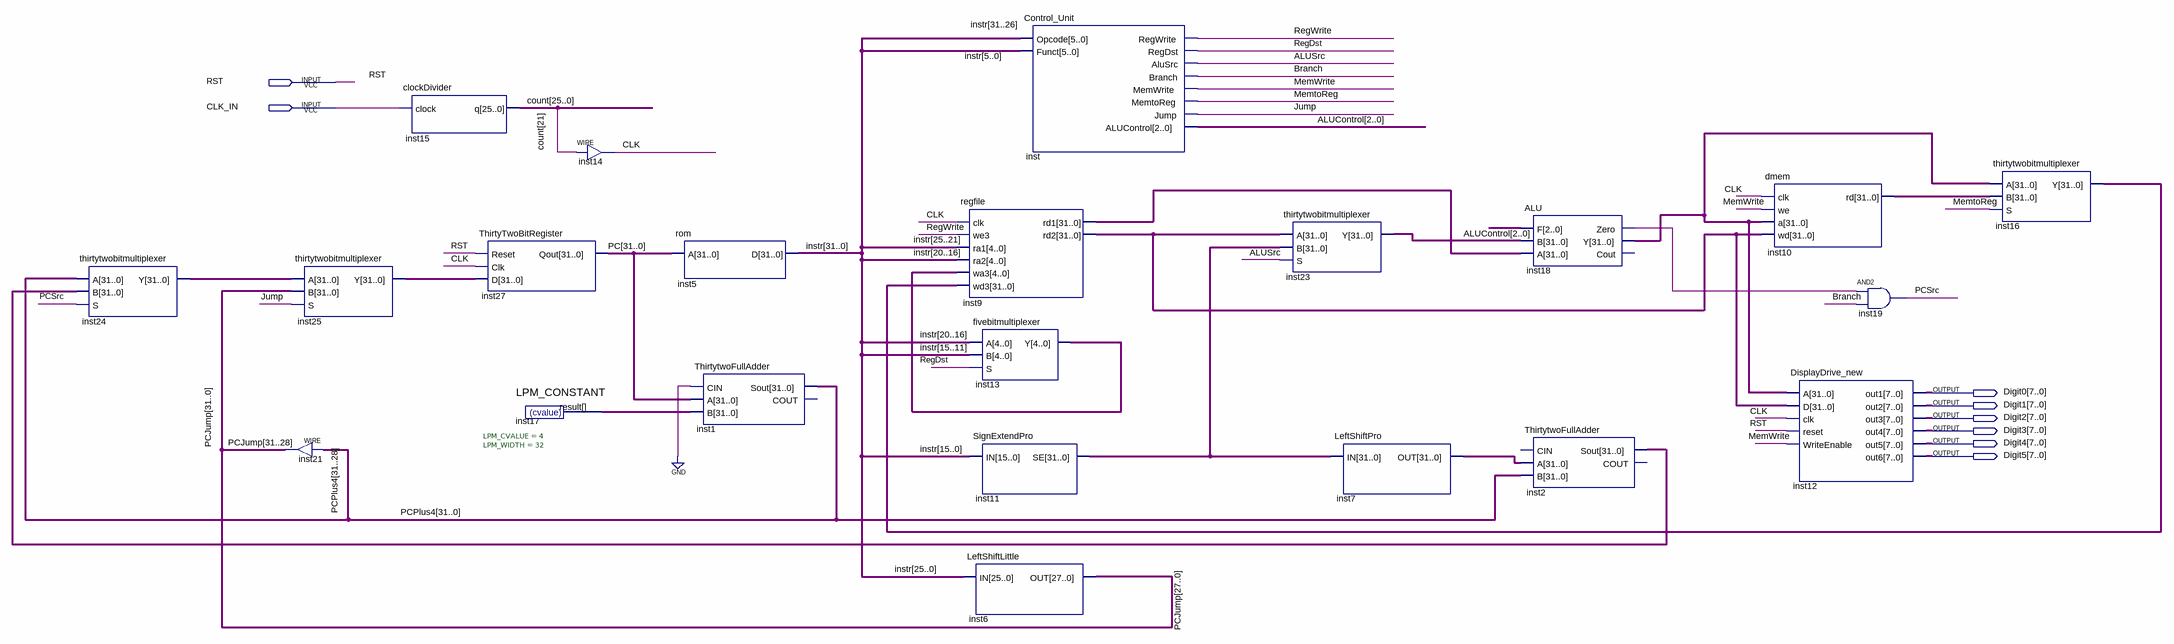
[diagram p0: schematic sheet]
// Quartus schematic CPU.bdf as structural Verilog: 22 symbols, 8 pins
module CPU (
  input  RST,
  input  CLK_IN,
  output [7:0] Digit0,
  output [7:0] Digit1,
  output [7:0] Digit2,
  output [7:0] Digit3,
  output [7:0] Digit4,
  output [7:0] Digit5
);

  wire ALUSrc, Branch, CLK, inst18_zero, Jump, MemtoReg, MemWrite, PCSrc, RegDst, RegWrite;
  wire [2:0] ALUControl;
  wire [4:0] inst13_y;
  wire [25:0] count;
  wire [31:0] inst2_sout, inst7_out, inst9_rd1, inst9_rd2, inst10_rd, inst11_se, inst16_y, inst17_result,
       inst18_y, inst23_y, inst24_y, inst25_y, instr, PC, PCJump, PCPlus4;

  thirtytwobitmultiplexer inst24 (.A(PCPlus4), .B(inst2_sout), .S(PCSrc), .Y(inst24_y));
  thirtytwobitmultiplexer inst25 (.A(inst24_y), .B(PCJump), .S(Jump), .Y(inst25_y));
  assign PCJump[31:28] = PCPlus4[31:28];  // WIRE inst21
  clockDivider inst15 (.clock(CLK_IN), .q(count));
  ThirtyTwoBitRegister inst27 (.Reset(RST), .Clk(CLK), .D(inst25_y), .Qout(PC));
  LPM_CONSTANT #(.LPM_CVALUE(4), .LPM_WIDTH(32)) inst17 (.result(inst17_result));
  assign CLK = count[21];  // WIRE inst14
  rom inst5 (.A(PC), .D(instr));
  ThirtytwoFullAdder inst1 (.CIN(1'b0), .A(PC), .B(inst17_result), .Sout(PCPlus4));  // open: COUT
  regfile inst9 (
    .clk(CLK), .we3(RegWrite), .ra1(instr[25:21]), .ra2(instr[20:16]), .wa3(inst13_y), .wd3(inst16_y),
    .rd1(inst9_rd1), .rd2(inst9_rd2));
  fivebitmultiplexer inst13 (.A(instr[20:16]), .B(instr[15:11]), .S(RegDst), .Y(inst13_y));
  SignExtendPro inst11 (.IN(instr[15:0]), .SE(inst11_se));
  LeftShiftLittle inst6 (.IN(instr[25:0]), .OUT(PCJump[27:0]));
  Control_Unit inst (
    .Opcode(instr[31:26]), .Funct(instr[5:0]), .RegWrite(RegWrite), .RegDst(RegDst), .AluSrc(ALUSrc),
    .Branch(Branch), .MemWrite(MemWrite), .MemtoReg(MemtoReg), .Jump(Jump), .ALUControl(ALUControl));
  thirtytwobitmultiplexer inst23 (.A(inst9_rd2), .B(inst11_se), .S(ALUSrc), .Y(inst23_y));
  LeftShiftPro inst7 (.IN(inst11_se), .OUT(inst7_out));
  ALU inst18 (.F(ALUControl), .B(inst23_y), .A(inst9_rd1), .Zero(inst18_zero), .Y(inst18_y));  // open: Cout
  ThirtytwoFullAdder inst2 (.A(inst7_out), .B(PCPlus4), .Sout(inst2_sout));  // open: CIN, COUT
  dmem inst10 (.clk(CLK), .we(MemWrite), .a(inst18_y), .wd(inst9_rd2), .rd(inst10_rd));
  DisplayDrive_new inst12 (
    .A(inst18_y), .D(inst9_rd2), .clk(CLK), .reset(RST), .WriteEnable(MemWrite), .out1(Digit0),
    .out2(Digit1), .out3(Digit2), .out4(Digit3), .out5(Digit4), .out6(Digit5));
  and inst19 (PCSrc, inst18_zero, Branch);
  thirtytwobitmultiplexer inst16 (.A(inst18_y), .B(inst10_rd), .S(MemtoReg), .Y(inst16_y));
endmodule
